# Altium project Urukul.PrjPCB (part 6 of 11)

## Sheet Urukul_FPGA_Config.SchDoc: =DocumentName
size A3; DocumentNumber: 1; Revision: 0; SheetNumber: 17; SheetTotal: 20; Version: 1.6; Author 1: Grzegorz Kasprowicz; Author 2: Filip Światkowski, Paweł Kulik, Maciej Przybysz; Author 3: Krzysztof Belewicz; Github: https://github.com/sinara-hw/Urukul; Last modified by: Krzysztof Belewicz
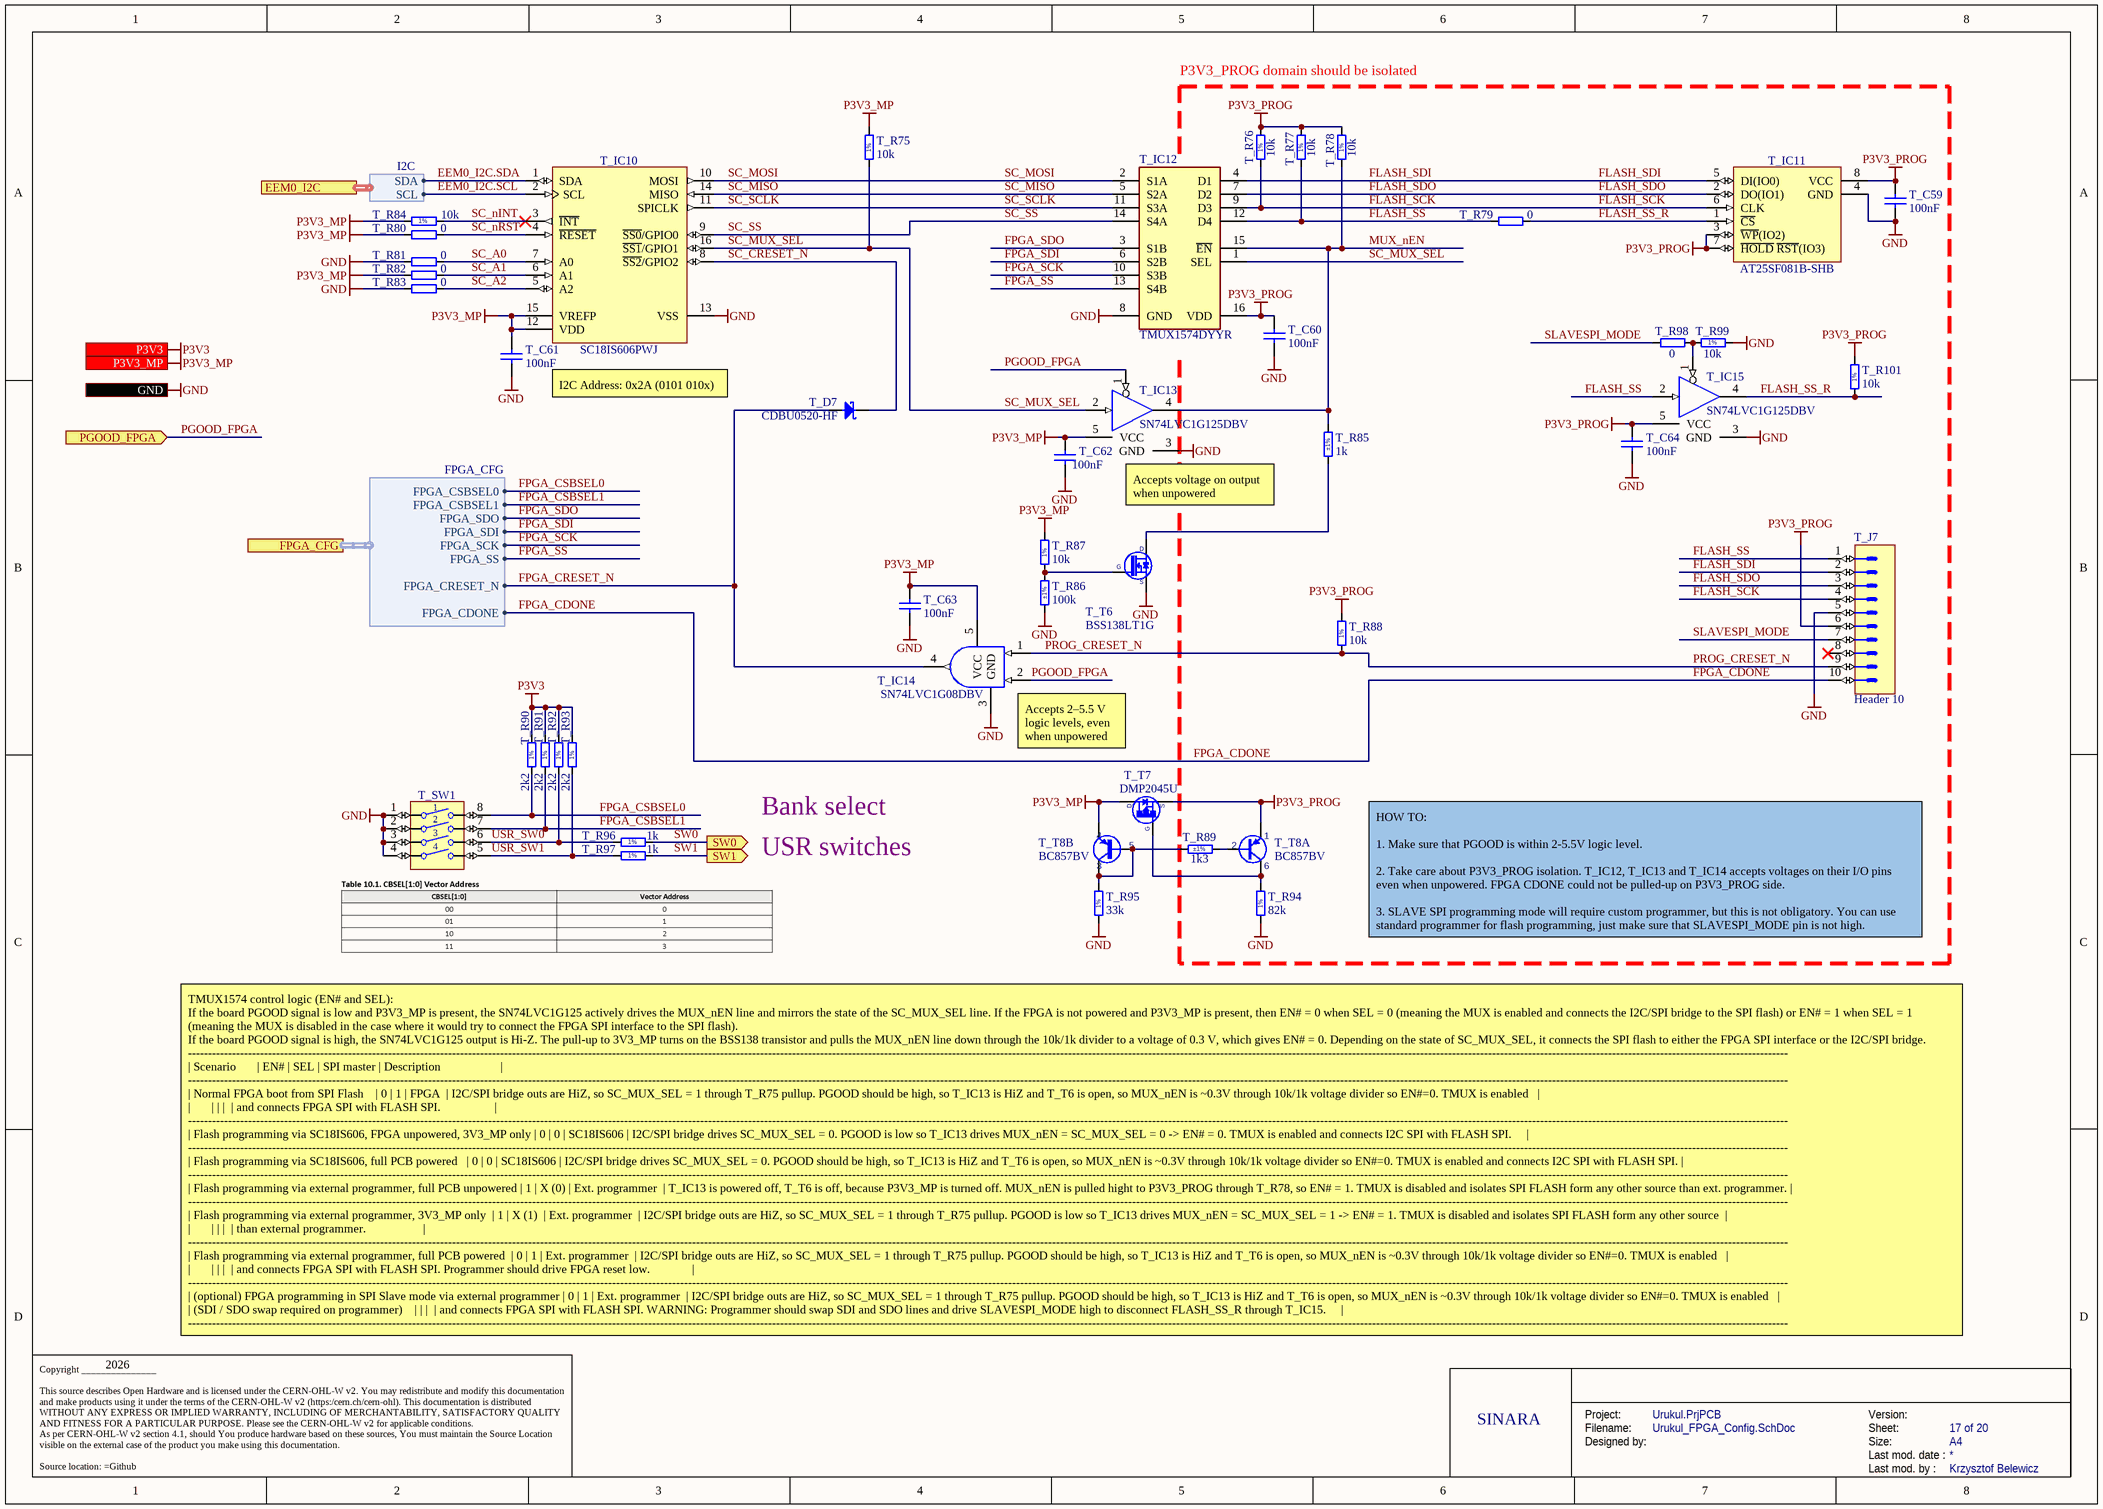
[diagram p13: Urukul_FPGA_Config.SchDoc]

### Parts
T_C59  100nF  [CAPC1005X55N]
T_C60  100nF  [CAPC1005X55N]
T_C61  100nF  [CAPC1005X55N]
T_C62  100nF  [CAPC1005X55N]
T_C63  100nF  [CAPC1005X55N]
T_C64  100nF  [CAPC1005X55N]
T_D7  CDBU0520-HF  [SOD-523F]
T_IC10  SC18IS606PWJ  [SOP65P640X110-16N]
T_IC11  AT25SF081B-SHB  [SOIC127P790X216-8N]
T_IC12  TMUX1574DYYR  [SOP50P326X110-16N]
T_IC13  SN74LVC1G125DBV  [SOT95P280X145-5N]
T_IC14  SN74LVC1G08DBV  [SOT95P280X145-5N]
T_IC15  SN74LVC1G125DBV  [SOT95P280X145-5N]
T_J7  Header 10  [HARWIN_M20-9980546]
T_R75  10k  [RESC1005X40N]
T_R76  10k  [RESC1005X40N]
T_R77  10k  [RESC1005X40N]
T_R78  10k  [RESC1005X40N]
T_R79  0  [RESC1005X40N]
T_R80  0  [RESC1005X40N]
T_R81  0  [RESC1005X40N]
T_R82  0  [RESC1005X40N]
T_R83  0  [RESC1005X40N]
T_R84  10k  [RESC1005X40N]
T_R85  1k  Tolerance: ±1%  [RESC1005X40N]
T_R86  100k  Tolerance: ±1%  [RESC1005X40N]
T_R87  10k  [RESC1005X40N]
T_R88  10k  [RESC1005X40N]
T_R89  1k3  Tolerance: ±1%  [RESC1005X40N]
T_R90  2k2  [RESC1005X40N]
T_R91  2k2  [RESC1005X40N]
T_R92  2k2  [RESC1005X40N]
T_R93  2k2  [RESC1005X40N]
T_R94  82k  [RESC1608X55N]
T_R95  33k  [RESC1005X40N]
T_R96  1k  [RESC1005X40N]
T_R97  1k  [RESC1005X40N]
T_R98  0  [RESC1005X40N]
T_R99  10k  [RESC1005X40N]
T_R101  10k  [RESC1005X40N]
T_SW1  Switch  [SW_TYCO_1571983-4]  (value not drawn)
T_T6  BSS138LT1G  [SOT95P240X110-3N]
T_T7  DMP2045U  [SOT95P240X110-3N]
T_T8  BC857BV  [SOTFL50P160X60-6N]  (parts A,B of 2)

### Ports
EEM0_I2C (harness I2C), FPGA_CFG (harness FPGA_CFG), GND, P3V3 (in), P3V3_MP (in), PGOOD_FPGA (in), SW0 (out), SW1 (out)

### Harnesses
FPGA_CFG: FPGA_CSBSEL0, FPGA_CSBSEL1, FPGA_SDO, FPGA_SDI, FPGA_SCK, FPGA_SS, FPGA_CRESET_N, FPGA_CDONE
I2C: SDA, SCL

### Nets
GND: T_C59.1 T_C60.1 T_C61.1 T_C62.1 T_C63.1 T_C64.1 T_IC10.13(VSS) T_IC11.4(GND) T_IC12.8(GND) T_IC13.3(GND) T_IC14.3(GND) T_IC15.3(GND) T_J7.5 T_R81.2 T_R83.2 T_R86.2 T_R94.1 T_R95.1 T_R99.2 T_SW1.1 T_SW1.2 T_SW1.3 T_SW1.4 T_T6.2(S) ; port GND
P3V3: T_R90.2 T_R91.2 T_R92.2 T_R93.2 ; port P3V3
P3V3_MP: T_C61.2 T_C62.2 T_C63.2 T_IC10.12(VDD) T_IC10.15(VREFP) T_IC13.5(VCC) T_IC14.5(VCC) T_R75.2 T_R80.2 T_R82.2 T_R84.1 T_R87.2 T_T7.3(D) T_T8.4(E) ; port P3V3_MP
P3V3_PROG: T_C59.2 T_C60.2 T_C64.2 T_IC11.3(~{WP}(IO2)) T_IC11.7(~{HOLD}_~{RST}(IO3)) T_IC11.8(VCC) T_IC12.16(VDD) T_IC15.5(VCC) T_J7.6 T_R76.2 T_R77.2 T_R78.2 T_R88.2 T_R101.2 T_T7.2(S) T_T8.1(E)
EEM0_I2C.SCL: T_IC10.2(SCL) ; port EEM0_I2C.SCL
EEM0_I2C.SDA: T_IC10.1(SDA) ; port EEM0_I2C.SDA
FLASH_SCK: T_IC11.6(CLK) T_IC12.9(D3) T_J7.4 T_R76.1
FLASH_SDI: T_IC11.5(DI(IO0)) T_IC12.4(D1) T_J7.2
FLASH_SDO: T_IC11.2(DO(IO1)) T_IC12.7(D2) T_J7.3
FLASH_SS: T_IC12.12(D4) T_IC15.2(IN) T_J7.1 T_R77.1 T_R79.1
FLASH_SS_R: T_IC11.1(~{CS}) T_IC15.4(OUT) T_R79.2 T_R101.1
FPGA_CDONE: T_J7.10 ; port FPGA_CFG.FPGA_CDONE
FPGA_CRESET_N: T_D7.2(A) T_IC14.4(Y) ; port FPGA_CFG.FPGA_CRESET_N  [project net FPGA_CFG.FPGA_CRESET_N]
FPGA_CSBSEL0: T_R90.1 T_SW1.8 ; port FPGA_CFG.FPGA_CSBSEL0  [project net FPGA_CFG.FPGA_CSBSEL0]
FPGA_CSBSEL1: T_R91.1 T_SW1.7 ; port FPGA_CFG.FPGA_CSBSEL1  [project net FPGA_CFG.FPGA_CSBSEL1]
FPGA_SCK: T_IC12.10(S3B) ; port FPGA_CFG.FPGA_SCK  [project net FPGA_CFG.FPGA_SCK]
FPGA_SDI: T_IC12.6(S2B) ; port FPGA_CFG.FPGA_SDI  [project net FPGA_CFG.FPGA_SDI]
FPGA_SDO: T_IC12.3(S1B) ; port FPGA_CFG.FPGA_SDO  [project net FPGA_CFG.FPGA_SDO]
FPGA_SS: T_IC12.13(S4B) ; port FPGA_CFG.FPGA_SS  [project net FPGA_CFG.FPGA_SS]
MUX_nEN: T_IC12.15(~{EN}) T_IC13.4(OUT) T_R78.1 T_R85.2
PGOOD_FPGA: T_IC13.1(~{G}) T_IC14.2(B) ; port PGOOD_FPGA
PROG_CRESET_N: T_IC14.1(A) T_J7.9 T_R88.1
SC_A0: T_IC10.7(A0) T_R81.1
SC_A1: T_IC10.6(A1) T_R82.1
SC_A2: T_IC10.5(A2) T_R83.1
SC_CRESET_N: T_D7.1(C) T_IC10.8(~{SS2}/GPIO2)
SC_MISO: T_IC10.14(MISO) T_IC12.5(S2A)
SC_MOSI: T_IC10.10(MOSI) T_IC12.2(S1A)
SC_MUX_SEL: T_IC10.16(~{SS1}/GPIO1) T_IC12.1(SEL) T_IC13.2(IN) T_R75.1
SC_nINT: T_IC10.3(~{INT}) T_R84.2
SC_nRST: T_IC10.4(~{RESET}) T_R80.1
SC_SCLK: T_IC10.11(SPICLK) T_IC12.11(S3A)
SC_SS: T_IC10.9(~{SS0}/GPIO0) T_IC12.14(S4A)
SLAVESPI_MODE: T_J7.7 T_R98.1
SW0: T_R96.1 ; port SW0
SW1: T_R97.1 ; port SW1
USR_SW0: T_R92.1 T_R96.2 T_SW1.6
USR_SW1: T_R93.1 T_R97.2 T_SW1.5
NetT_IC15_1: T_IC15.1(~{G}) T_R98.2 T_R99.1
NetT_R85_1: T_R85.1 T_T6.3(D)
NetT_R86_1: T_R86.1 T_R87.1 T_T6.1(G)
NetT_R89_1: T_R89.1 T_T8.2(B)
NetT_R89_2: T_R89.2 T_R95.2 T_T8.3(C) T_T8.5(B)
NetT_R94_2: T_R94.2 T_T7.1(G) T_T8.6(C)

Not connected (* = marked no-connect by the designer): T_J7 8*

### Notes on the sheet
- P3V3_PROG domain should be isolated
- I2C Address: 0x2A (0101 010x)
- (near T_IC13) Accepts voltage on output when unpowered
- (near T_IC14) Accepts 2–5.5 V logic levels, even when unpowered
- Bank select
- USR switches
- HOW TO:
  1. Make sure that PGOOD is within 2-5.5V logic level.
  2. Take care about P3V3_PROG isolation. T_IC12, T_IC13 and T_IC14 accepts voltages on their I/O pins even when unpowered. FPGA CDONE could not be pulled-up on P3V3_PROG side.
  3. SLAVE SPI programming mode will require custom programmer, but this is not obligatory. You can use standard programmer for flash programming, just make sure that SLAVESPI_MODE pin is not high.
- 2026
- TMUX1574 control logic (EN# and SEL):
  If the board PGOOD signal is low and P3V3_MP is present, the SN74LVC1G125 actively drives the MUX_nEN line and mirrors the state of the SC_MUX_SEL line. If the FPGA is not powered and P3V3_MP is present, then EN# = 0 when SEL = 0 (meaning the MUX is enabled and connects the I2C/SPI bridge to the SPI flash) or EN# = 1 when SEL = 1 (meaning the MUX is disabled in the case where it would try to connect the FPGA SPI interface to the SPI flash).
  If the board PGOOD signal is high, the SN74LVC1G125 output is Hi-Z. The pull-up to 3V3_MP turns on the BSS138 transistor and pulls the MUX_nEN line down through the 10k/1k divider to a voltage of 0.3 V, which gives EN# = 0. Depending on the state of SC_MUX_SEL, it connects the SPI flash to either the FPGA SPI interface or the I2C/SPI bridge.
  -------------------------------------------------------------------------------------------------------------------------------------------------------------------------------------------------------------------------------------------------------------------------------------------------------------------------------------------------------------------------------------------------------------------------------------------------
  | Scenario							| EN#	| SEL	| SPI master	| Description																				|
  -------------------------------------------------------------------------------------------------------------------------------------------------------------------------------------------------------------------------------------------------------------------------------------------------------------------------------------------------------------------------------------------------------------------------------------------------
  | Normal FPGA boot from SPI Flash				| 0	| 1	| FPGA		| I2C/SPI bridge outs are HiZ, so SC_MUX_SEL = 1 through T_R75 pullup. PGOOD should be high, so T_IC13 is HiZ and T_T6 is open, so MUX_nEN is ~0.3V through 10k/1k voltage divider so EN#=0. TMUX is enabled 		|
  |							|	|	|		| and connects FPGA SPI with FLASH SPI.																		|
  -------------------------------------------------------------------------------------------------------------------------------------------------------------------------------------------------------------------------------------------------------------------------------------------------------------------------------------------------------------------------------------------------------------------------------------------------
  | Flash programming via SC18IS606, FPGA unpowered, 3V3_MP only	| 0	| 0	| SC18IS606	| I2C/SPI bridge drives SC_MUX_SEL = 0. PGOOD is low so T_IC13 drives MUX_nEN = SC_MUX_SEL = 0 -> EN# = 0. TMUX is enabled and connects I2C SPI with FLASH SPI.					|
  -------------------------------------------------------------------------------------------------------------------------------------------------------------------------------------------------------------------------------------------------------------------------------------------------------------------------------------------------------------------------------------------------------------------------------------------------
  | Flash programming via SC18IS606, full PCB powered			| 0	| 0	| SC18IS606	| I2C/SPI bridge drives SC_MUX_SEL = 0. PGOOD should be high, so T_IC13 is HiZ and T_T6 is open, so MUX_nEN is ~0.3V through 10k/1k voltage divider so EN#=0. TMUX is enabled and connects I2C SPI with FLASH SPI.	|
  -------------------------------------------------------------------------------------------------------------------------------------------------------------------------------------------------------------------------------------------------------------------------------------------------------------------------------------------------------------------------------------------------------------------------------------------------
  | Flash programming via external programmer, full PCB unpowered	| 1	| X (0)	| Ext. programmer 	| T_IC13 is powered off, T_T6 is off, because P3V3_MP is turned off. MUX_nEN is pulled hight to P3V3_PROG through T_R78, so EN# = 1. TMUX is disabled and isolates SPI FLASH form any other source than ext. programmer.	|
  -------------------------------------------------------------------------------------------------------------------------------------------------------------------------------------------------------------------------------------------------------------------------------------------------------------------------------------------------------------------------------------------------------------------------------------------------
  | Flash programming via external programmer, 3V3_MP only		| 1	| X (1) 	| Ext. programmer 	| I2C/SPI bridge outs are HiZ, so SC_MUX_SEL = 1 through T_R75 pullup. PGOOD is low so T_IC13 drives MUX_nEN = SC_MUX_SEL = 1 -> EN# = 1. TMUX is disabled and isolates SPI FLASH form any other source		|
  |							|	|	|		| than external programmer.																			|
  -------------------------------------------------------------------------------------------------------------------------------------------------------------------------------------------------------------------------------------------------------------------------------------------------------------------------------------------------------------------------------------------------------------------------------------------------
  | Flash programming via external programmer, full PCB powered		| 0	| 1	| Ext. programmer 	| I2C/SPI bridge outs are HiZ, so SC_MUX_SEL = 1 through T_R75 pullup. PGOOD should be high, so T_IC13 is HiZ and T_T6 is open, so MUX_nEN is ~0.3V through 10k/1k voltage divider so EN#=0. TMUX is enabled 		|
  |							|	|	|		| and connects FPGA SPI with FLASH SPI. Programmer should drive FPGA reset low.														|
  -------------------------------------------------------------------------------------------------------------------------------------------------------------------------------------------------------------------------------------------------------------------------------------------------------------------------------------------------------------------------------------------------------------------------------------------------
  | (optional) FPGA programming in SPI Slave mode via external programmer	| 0	| 1	| Ext. programmer 	| I2C/SPI bridge outs are HiZ, so SC_MUX_SEL = 1 through T_R75 pullup. PGOOD should be high, so T_IC13 is HiZ and T_T6 is open, so MUX_nEN is ~0.3V through 10k/1k voltage divider so EN#=0. TMUX is enabled 		|
  | (SDI / SDO swap required on programmer)				|	|	|		| and connects FPGA SPI with FLASH SPI. WARNING: Programmer should swap SDI and SDO lines and drive SLAVESPI_MODE high to disconnect FLASH_SS_R through T_IC15.					|
  -------------------------------------------------------------------------------------------------------------------------------------------------------------------------------------------------------------------------------------------------------------------------------------------------------------------------------------------------------------------------------------------------------------------------------------------------
- SINARA
- Project:
- Designed by:
- Filename:
- Size:
- Version:
- Last mod. date :
- Sheet:
- A4
- Copyright _______________
  This source describes Open Hardware and is licensed under the CERN-OHL-W v2. You may redistribute and modify this documentation and make products using it under the terms of the CERN-OHL-W v2 (https:/cern.ch/cern-ohl). This documentation is distributed WITHOUT ANY EXPRESS OR IMPLIED WARRANTY, INCLUDING OF MERCHANTABILITY, SATISFACTORY QUALITY AND FITNESS FOR A PARTICULAR PURPOSE. Please see the CERN-OHL-W v2 for applicable conditions.
  As per CERN-OHL-W v2 section 4.1, should You produce hardware based on these sources, You must maintain the Source Location visible on the external case of the product you make using this documentation.
  Source location: =Github
- Last mod. by :
- (in symbol R0402_1K_1%_0.0625W_100PPM) 1%
- (in symbol R0402_2K2_1%_0.0625W_100PPM) 1%
- (in symbol R0402_10K_1%_0.0625W_100PPM) 1%
- (in symbol R0402_33K_1%_0.0625W_100PPM) 1%
- (in symbol R0603_82K_1%_0.1W_100PPM) 1%

### Library data of the parts
T_C59-T_C64 = CC0402_100NF_16V_10%_X5R: as C85 on sheet Urukul_FPGA; Part Number: CC0402_100NF_16V_10%_X5R; Component Kind: Standard; Component Type: Standard; Pin Count: 2; Value: 100nF; Status: None; Manufacturer Part Number: CC0402_100NF_16V_10%_X5R; Case: 0402; Mounted: Yes; Socket: No; SMD: Yes; Sense: No; Manufacturer1 Example: MURATA; Manufacturer1 ComponentHeight: 0.55mm; HelpURL: \\cern.ch\dfs\Applications\Altium\Datasheets\CC0402_X5R_MURATA_GRM.pdf; Author: CERN DEM JLC; CreateDate: 10.12.2013; LatestRevisionDate: 10.12.2013
T_D7 = CDBU0520-HF: Schottky Diode; Part Description: 20V Surface mount Schottky Barrier Diode; Manufacturer: COMCHIP; Voltage: 20V; Power: 500mA; PressFit: No; Bonding: No; Part Number: CDBU0520-HF; Component Kind: Standard; Component Type: Standard; Device: CDBU0520-HF; PackageDescription: Small Outline Diode Flat Lead (SOD-523F), Body; 1.80mm L X 1mm W X 0.85mm H; Manufacturer Part Number: CDBU0520-HF; Pin Count: 2; Case: SOD-523F; Mounted: Yes; Socket: No; SMD: Yes; Sense: No; ComponentHeight: 1mm; HelpURL: \\cern.ch\dfs\Applications\Altium\Datasheets\CDBU0520-HF.pdf; Author: CERN DEM HF; CreateDate: 13.10.2023; LatestRevisionDate: 13.10.2023
T_IC10 = SC18IS606PWJ: I2C-bus to SPI bridge; Manufacturer: NXP SEMICONDUCTORS; PressFit: No; Bonding: No; Part Number: SC18IS606PWJ; Component Kind: Standard; Component Type: Standard; Device: SC18IS606PWJ; PackageDescription: SOP, 0.65mm pitch; 16 pin, 4.40mm W X 5.00mm L X 1.10mm H body IPC Medium Density; Part Description: I2C-Bus to SPI Bridge; Manufacturer Part Number: SC18IS606PWJ; Pin Count: 16; Case: TSSOP16; Mounted: Yes; Socket: No; SMD: Yes; Sense: No; ComponentHeight: 1.1mm; HelpURL: \\cern.ch\dfs\Applications\Altium\Datasheets\SC18IS602B.pdf; Author: GK; CreateDate: 14/12/2015; LatestRevisionDate: 14/12/2015
T_IC11 = MEM_AT25SF081B-SHB: 8M-bit Serial Flash Memory with uniform 4KB sectors and Dual/Quad SPI and QPI; Manufacturer: Renesas; PressFit: No; Bonding: No; Part Number: AT25SF081B-SHB; Component Kind: Standard; Component Type: Standard; Device: AT25SF081B-SHB; PackageDescription: SOIC, 1.27mm Pitch; 8 Pin, 5.285mm W X 5.335mm L X 2.16mm H body, IPC Medium Density; Part Description: 8M-bit Serial Flash Memory with uniform 4KB sectors and Dual/Quad SPI and QPI; Manufacturer Part Number: AT25SF081B-SHB; Pin Count: 8; Case: SOIC8; Mounted: Yes; Socket: No; SMD: Yes; Sense: No; ComponentHeight: 2.16mm; HelpURL: \\cern.ch\dfs\Applications\Altium\Datasheets\W25Q128FVSIG.pdf; Author: GK; CreateDate: 26/01/2018; LatestRevisionDate: 26/01/2018
T_IC12 = TMUX1574DYYR: Integrated Circuit; Manufacturer_Name: Texas Instruments; Datasheet Link: https://www.ti.com/lit/gpn/TMUX1574; Height: 1.1mm; Manufacturer_Part_Number: TMUX1574DYYR; Mouser Part Number: 595-TMUX1574DYYR; Mouser Price/Stock: https://www.mouser.co.uk/ProductDetail/Texas-Instruments/TMUX1574DYYR?qs=B6kkDfuK7%2FDgs0e8M6dtlw%3D%3D; Arrow Part Number: TMUX1574DYYR; Arrow Price/Stock: https://www.arrow.com/en/products/tmux1574dyyr/texas-instruments.html?utm_currency=USD&region=nac
T_IC13 T_IC15 = SN74LVC1G125DBV: Single Bus Buffer Gate With 3-State Output; Part Description: Single Bus Buffer Gate with 3-State Outputs; Manufacturer: TEXAS INSTRUMENTS; PressFit: No; Bonding: No; Part Number: SN74LVC1G125DBV; Component Kind: Standard; Component Type: Standard; Device: SN74LVC1G125DBV; PackageDescription: SOT, 0.95mm Pitch; 5 Pin, 1.60mm W X 2.90mm L X 1.45mm H body, IPC Medium Density; Manufacturer Part Number: SN74LVC1G125DBV; Pin Count: 5; Case: SOT23-5; Mounted: Yes; Socket: No; SMD: Yes; Sense: No; ComponentHeight: 1.45mm; Author: CERN DEM HF; HelpURL: \\cern.ch\dfs\Applications\Altium\Datasheets\SN74LVC1G125.pdf; CreateDate: 15.11.2022; LatestRevisionDate: 15.11.2022
T_IC14 = SN74LVC1G08DBV: Single 2-Input AND Gate; Part Description: Single 2-Input Positive-AND Gate; Manufacturer: TEXAS INSTRUMENTS; PressFit: No; Bonding: No; Part Number: SN74LVC1G08DBV; Component Kind: Standard; Component Type: Standard; Device: SN74LVC1G08DBV; PackageDescription: SOT, 0.95mm Pitch; 5 Pin, 1.60mm W X 2.90mm L X 1.45mm H body, IPC Medium Density; Manufacturer Part Number: SN74LVC1G08DBV; Pin Count: 5; Case: SOT23-5; Mounted: Yes; Socket: No; SMD: Yes; Sense: No; ComponentHeight: 1.45mm; Author: CERN DEM JLC; HelpURL: \\cern.ch\dfs\Applications\Altium\Datasheets\SN74LVC1G08.pdf; CreateDate: 28.08.2012; LatestRevisionDate: 27.10.2021
T_J7 = HARWIN_M20-9980546: Connector 10 Male; Part Description: 10 Contacts - Pitch 2.54mm - Dual Row Straight Header (Lead Length 6.1mm, Insulator 2.54mm); Manufacturer: HARWIN; PressFit: No; Part Number: HARWIN_M20-9980546; Component Kind: Standard; Component Type: Standard; Pin Count: 10; Family: Header 10; Mounted: Yes; Socket: No; SMD: No; Sense: No; Status: None; Manufacturer Part Number: M20-9980546; ComponentHeight: 8.64mm; HelpURL: \\cern.ch\dfs\Applications\Altium\Datasheets\HARWIN_M20-9980546.pdf; Author: CERN DEM MR; CreateDate: 9/15/2017; LatestRevisionDate: 9/15/2017
T_R75-T_R78 T_R84 T_R87 T_R88 T_R99 T_R101 = R0402_10K_1%_0.0625W_100PPM: Resistor - 1%; Part Description: General Purpose Thick Film Chip Resistor; Manufacturer: GENERIC; Manufacturer1 Part Number: 232270671003L; TC: ±100ppm/°C; Table: Resistors SMD; Part Number: R0402_10K_1%_0.0625W_100PPM; Component Kind: Standard; Component Type: Standard; Pin Count: 2; Value: 10k; Status: Not recommended; Power: 0.0625W; Tolerance: ±1%; Manufacturer Part Number: R0402_10K_1%_0.0625W_100PPM; Case: 0402; Mounted: Yes; Socket: No; SMD: Yes; Manufacturer1 Example: YAGEO PHYCOMP; Manufacturer1 ComponentHeight: 0.4mm; HelpURL: \\cern.ch\dfs\Applications\Altium\Datasheets\R0402_Phycomp_RC0402.pdf; Author: CERN DEM JLC; CreateDate: 2007-12-03; LatestRevisionDate: 2012-10-17
T_R79-T_R83 T_R98 = R0402_0R_JUMPER: Resistor; Part Description: 1A (0.05R Max DC Resistance) Zero Ohm Jumper; Manufacturer: GENERIC; Manufacturer1 Part Number: 232270591001L; PressFit: No; Part Number: R0402_0R_JUMPER; Component Kind: Standard; Component Type: Standard; Pin Count: 2; Value: 0; Status: Not Recommended; Manufacturer Part Number: R0402_0R_JUMPER; Case: 0402; Mounted: Yes; Sense: No; Socket: No; SMD: Yes; Manufacturer1 Example: YAGEO PHYCOMP; Manufacturer1 ComponentHeight: 0.4mm; HelpURL: \\cern.ch\dfs\Applications\Altium\Datasheets\R0402_Phycomp_RC0402.pdf; Author: CERN DEM JLC; CreateDate: 03.12.2007; LatestRevisionDate: 17.10.2012
T_R85 T_R96 T_R97 = R0402_1K_1%_0.0625W_100PPM: as R31 on sheet CLK_SYNC; Part Number: R0402_1K_1%_0.0625W_100PPM; Component Kind: Standard; Component Type: Standard; Pin Count: 2; Value: 1k; Status: Not Recommended; Power: 0.0625W; Manufacturer Part Number: R0402_1K_1%_0.0625W_100PPM; Case: 0402; Mounted: Yes; Sense: No; Socket: No; SMD: Yes; Manufacturer1 Example: YAGEO PHYCOMP; Manufacturer1 ComponentHeight: 0.4mm; HelpURL: \\cern.ch\dfs\Applications\Altium\Datasheets\R0402_Phycomp_RC0402.pdf; Author: CERN DEM JLC; CreateDate: 03.12.2007; LatestRevisionDate: 17.10.2012
  T_R96 T_R97: Tolerance: ±1%
T_R86 = R0402_100K_1%_0.0625W_100PPM: Resistor - 1%; Part Description: General Purpose Thick Film Chip Resistor; Manufacturer: GENERIC; Manufacturer1 Part Number: 232270671004L; TC: ±100ppm/°C; PressFit: No; Part Number: R0402_100K_1%_0.0625W_100PPM; Component Kind: Standard; Component Type: Standard; Pin Count: 2; Value: 100k; Status: Not Recommended; Power: 0.0625W; Manufacturer Part Number: R0402_100K_1%_0.0625W_100PPM; Case: 0402; Mounted: Yes; Sense: No; Socket: No; SMD: Yes; Manufacturer1 Example: YAGEO PHYCOMP; Manufacturer1 ComponentHeight: 0.4mm; HelpURL: \\cern.ch\dfs\Applications\Altium\Datasheets\R0402_Phycomp_RC0402.pdf; Author: CERN DEM JLC; CreateDate: 03.12.2007; LatestRevisionDate: 17.10.2012
T_R89 = R0402_1K3_1%_0.0625W_100PPM: Resistor - 1%; Part Description: General Purpose Thick Film Chip Resistor; Manufacturer: GENERIC; Manufacturer1 Part Number: 232270671302L; TC: ±100ppm/°C; PressFit: No; Part Number: R0402_1K3_1%_0.0625W_100PPM; Component Kind: Standard; Component Type: Standard; Pin Count: 2; Value: 1k3; Status: Not Recommended; Power: 0.0625W; Manufacturer Part Number: R0402_1K3_1%_0.0625W_100PPM; Case: 0402; Mounted: Yes; Sense: No; Socket: No; SMD: Yes; Manufacturer1 Example: YAGEO PHYCOMP; Manufacturer1 ComponentHeight: 0.4mm; HelpURL: \\cern.ch\dfs\Applications\Altium\Datasheets\R0402_Phycomp_RC0402.pdf; Author: CERN DEM JLC; CreateDate: 03.12.2007; LatestRevisionDate: 17.10.2012
T_R90-T_R93 = R0402_2K2_1%_0.0625W_100PPM: Resistor - 1%; Part Description: General Purpose Thick Film Chip Resistor; Manufacturer: GENERIC; Manufacturer1 Part Number: 232270672202L; TC: ±100ppm/°C; Table: Resistors SMD; Part Number: R0402_2K2_1%_0.0625W_100PPM; Component Kind: Standard; Component Type: Standard; Pin Count: 2; Value: 2k2; Status: Not recommended; Power: 0.0625W; Tolerance: ±1%; Manufacturer Part Number: R0402_2K2_1%_0.0625W_100PPM; Case: 0402; Mounted: Yes; Socket: No; SMD: Yes; Manufacturer1 Example: YAGEO PHYCOMP; Manufacturer1 ComponentHeight: 0.4mm; HelpURL: \\cern.ch\dfs\Applications\Altium\Datasheets\R0402_Phycomp_RC0402.pdf; Author: CERN DEM JLC; CreateDate: 2007-12-03; LatestRevisionDate: 2012-10-17
T_R94 = R0603_82K_1%_0.1W_100PPM: Resistor - 1%; Part Description: General Purpose Thick Film Chip Resistor; Manufacturer: GENERIC; Manufacturer1 Part Number: NRC06F8202TRF; Power: 0.1W; TC: ±100ppm/°C; Part Number: R0603_82K_1%_0.1W_100PPM; Component Kind: Standard; Component Type: Standard; Pin Count: 2; Value: 82k; Status: Preferred; Tolerance: ±1%; Manufacturer Part Number: R0603_82K_1%_0.1W_100PPM; Case: 0603; Mounted: Yes; Sense: No; Socket: No; SMD: Yes; Manufacturer1 Example: NIC COMPONENT; Manufacturer1 ComponentHeight: 0.55mm; HelpURL: \\cern.ch\dfs\Applications\Altium\Datasheets\R0603_NIC_NRC.pdf; Author: CERN DEM JLC; CreateDate: 03.12.2007; LatestRevisionDate: 13.03.2008
T_R95 = R0402_33K_1%_0.0625W_100PPM: Resistor - 1%; Part Description: General Purpose Thick Film Chip Resistor; Manufacturer: GENERIC; Manufacturer1 Part Number: 232270673303L; TC: ±100ppm/°C; PressFit: No; Part Number: R0402_33K_1%_0.0625W_100PPM; Component Kind: Standard; Component Type: Standard; Pin Count: 2; Value: 33k; Status: Not Recommended; Power: 0.0625W; Tolerance: ±1%; Manufacturer Part Number: R0402_33K_1%_0.0625W_100PPM; Case: 0402; Mounted: Yes; Sense: No; Socket: No; SMD: Yes; Manufacturer1 Example: YAGEO PHYCOMP; Manufacturer1 ComponentHeight: 0.4mm; HelpURL: \\cern.ch\dfs\Applications\Altium\Datasheets\R0402_Phycomp_RC0402.pdf; Author: CERN DEM JLC; CreateDate: 03.12.2007; LatestRevisionDate: 17.10.2012
T_SW1 = SW_TYCO_1571983-4: as SW1 on sheet Urukul_FPGA; Part Number: SW_TYCO_1571983-4; Component Kind: Standard; Component Type: Standard; Pin Count: 8; PackageDescription: Pitch 1.27mm,  Body 6.2x6.2mm, 4 Ways SPST Surface-Mount DIP Switch, TYCO GDH Series; Family: Switch; Mounted: Yes; Socket: No; SMD: Yes; Sense: No; Status: None; ComponentHeight: 2.31mm; HelpURL: \\cern.ch\dfs\Applications\Altium\Datasheets\SW_TYCO_1571983-4.pdf; Author: CERN DEM JLC; CreateDate: 08/01/2009; LatestRevisionDate: 08/01/2009
T_T6 = BSS138LT1G: N-CHANNEL MOSFET WITH DIODE; Part Description: 50V, 200mA N-Channel Enhancement Mode Field-Effect Transistor; Manufacturer: ON SEMICONDUCTOR; PressFit: No; Bonding: No; Part Number: BSS138LT1G; Component Kind: Standard; Component Type: Standard; Device: BSS138LT1G; PackageDescription: SOT23, 0.95mm Pitch; 3 Pin, 1.40mm W X 3.00mm L X 1.10mm H body, IPC Medium Density; Manufacturer Part Number: BSS138L; Pin Count: 3; Case: SOT23-3; Mounted: Yes; Socket: No; SMD: Yes; Sense: No; ComponentHeight: 1.11mm; HelpURL: \\cern.ch\dfs\Applications\Altium\Datasheets\BSS138LT1G.pdf; Author: CERN DEM JLC; CreateDate: 23.03.2009; LatestRevisionDate: 25.05.2022
T_T7 = DMP2045U: P-CHANNEL MOSFET WITH DIODE; Part Description: 20V, 4.3A, P-Channel Enhancement Mode MOSFET; Manufacturer: DIODES INCORPORATED; PressFit: No; Bonding: No; Part Number: DMP2045U; Component Kind: Standard; Component Type: Standard; Device: DMP2045U; PackageDescription: SOT23, 0.95mm Pitch; 3 Pin, 1.40mm W X 3.00mm L X 1.10mm H body, IPC Medium Density; Manufacturer Part Number: DMP2045U; Pin Count: 3; Case: SOT23-3; Mounted: Yes; Socket: No; SMD: Yes; Sense: No; ComponentHeight: 1.4mm; HelpURL: \\cern.ch\dfs\Applications\Altium\Datasheets\DMP2045U.pdf; Author: CERN DEM HF; CreateDate: 24.09.2025; LatestRevisionDate: 24.09.2025
T_T8 = BC857BV: 45V, 100mA PNP General Purpose Double Transistor; Part Description: -45V -100mA PNP General Purpose Double Transistor; Manufacturer: NXP SEMICONDUCTORS; PressFit: No; Bonding: No; Part Number: BC857BV; Component Kind: Standard; Component Type: Standard; Device: BC857BV; PackageDescription: SOTFL (SOT666), 0.50mm, Pitch; 6 Pin, 1.20mm W X 1.60mm L X 0.60mm H Body, IPC Medium Density; Manufacturer Part Number: BC857BV; Pin Count: 6; Case: SOT666; Mounted: Yes; Socket: No; SMD: Yes; Sense: No; ComponentHeight: 0.6mm; HelpURL: \\cern.ch\dfs\Applications\Altium\Datasheets\BC857BV.pdf; Author: CERN DEM JLC; CreateDate: 01/12/2011; LatestRevisionDate: 01/12/2011

## Sheet Urukul_FPGA_LVDS.SchDoc: =DocumentName
size A3; DocumentNumber: 1; Revision: 0; SheetNumber: 15; SheetTotal: 17; Version: 1.6; Author 1: Grzegorz Kasprowicz; Author 2: Filip Światkowski, Paweł Kulik, Maciej Przybysz; Author 3: Krzysztof Belewicz; Github: https://github.com/sinara-hw/Urukul; Last modified by: Krzysztof Belewicz
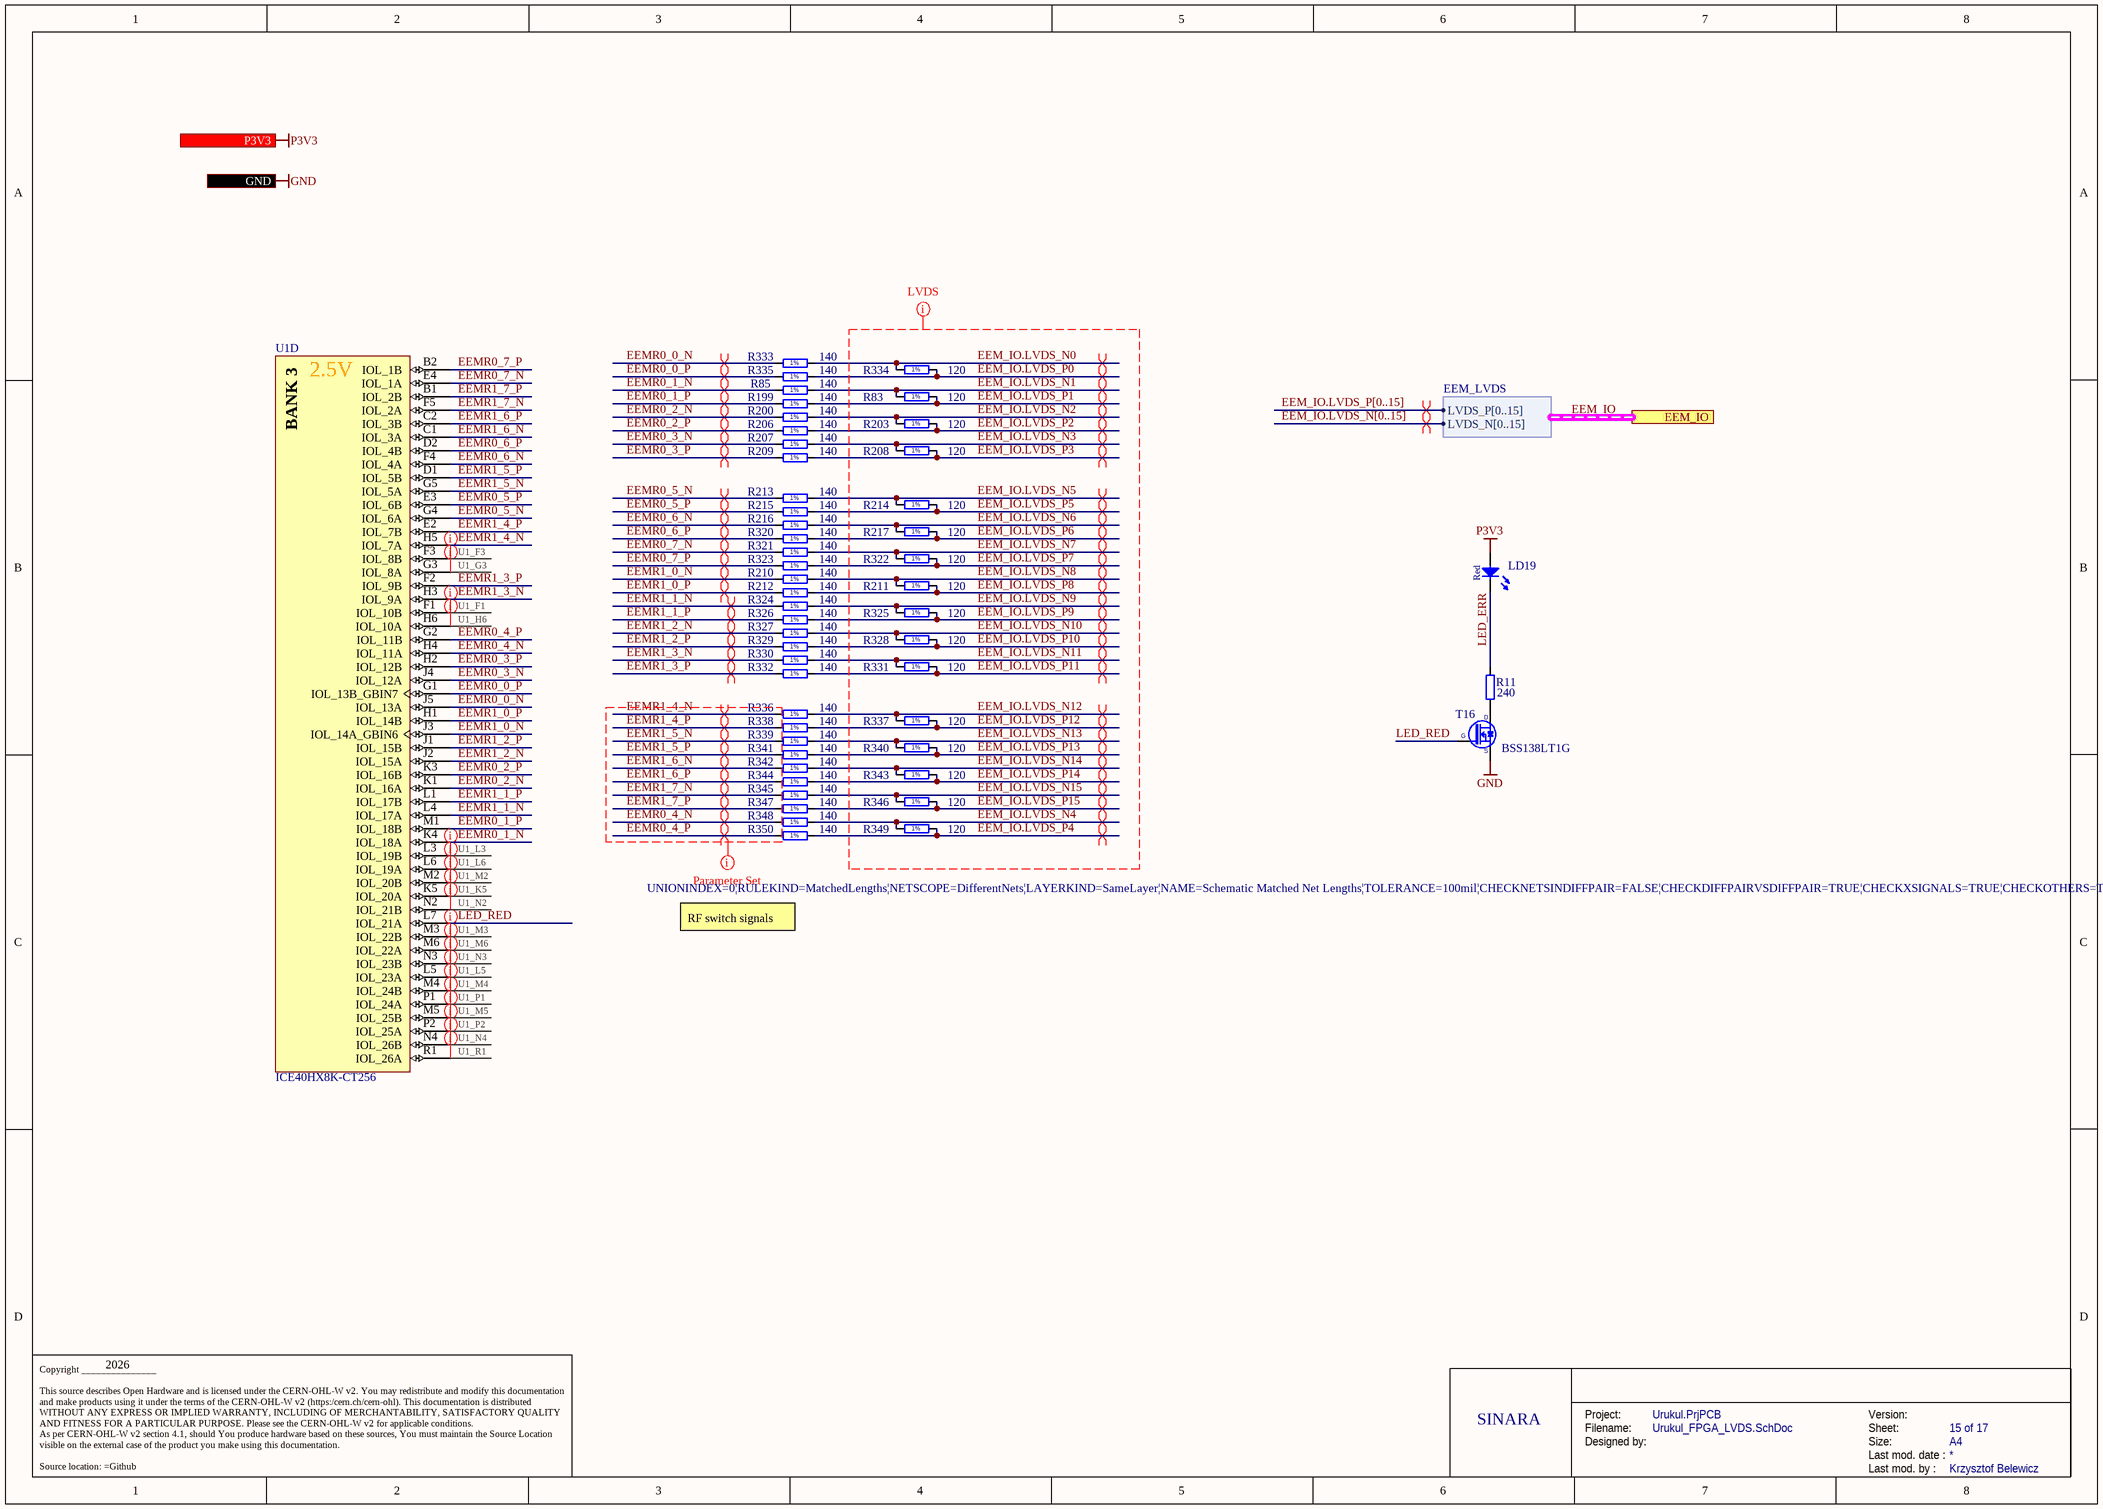
[diagram p14: Urukul_FPGA_LVDS.SchDoc]

### Parts
LD19  Red  [LED_AVAGO_HSMC-C120]
R11  240  [RESC1005X40N]
R83  120  [RESC1005X40N]
R85  140  [RESC0603X28N]
R199  140  [RESC0603X28N]
R200  140  [RESC0603X28N]
R203  120  [RESC1005X40N]
R206  140  [RESC0603X28N]
R207  140  [RESC0603X28N]
R208  120  [RESC1005X40N]
R209  140  [RESC0603X28N]
R210  140  [RESC0603X28N]
R211  120  [RESC1005X40N]
R212  140  [RESC0603X28N]
R213  140  [RESC0603X28N]
R214  120  [RESC1005X40N]
R215  140  [RESC0603X28N]
R216  140  [RESC0603X28N]
R217  120  [RESC1005X40N]
R320  140  [RESC0603X28N]
R321  140  [RESC0603X28N]
R322  120  [RESC1005X40N]
R323  140  [RESC0603X28N]
R324  140  [RESC0603X28N]
R325  120  [RESC1005X40N]
R326  140  [RESC0603X28N]
R327  140  [RESC0603X28N]
R328  120  [RESC1005X40N]
R329  140  [RESC0603X28N]
R330  140  [RESC0603X28N]
R331  120  [RESC1005X40N]
R332  140  [RESC0603X28N]
R333  140  [RESC0603X28N]
R334  120  [RESC1005X40N]
R335  140  [RESC0603X28N]
R336  140  [RESC0603X28N]
R337  120  [RESC1005X40N]
R338  140  [RESC0603X28N]
R339  140  [RESC0603X28N]
R340  120  [RESC1005X40N]
R341  140  [RESC0603X28N]
R342  140  [RESC0603X28N]
R343  120  [RESC1005X40N]
R344  140  [RESC0603X28N]
R345  140  [RESC0603X28N]
R346  120  [RESC1005X40N]
R347  140  [RESC0603X28N]
R348  140  [RESC0603X28N]
R349  120  [RESC1005X40N]
R350  140  [RESC0603X28N]
T16  BSS138LT1G  [SOT95P240X110-3N]
U1  ICE40HX8K-CT256  [LATC-caBGA-256]  (part D of 5)

### Ports
EEM_IO (harness EEM_LVDS), GND, P3V3 (in)

### Harnesses
EEM_LVDS: LVDS_P[0..15], LVDS_N[0..15]

### Nets
GND: T16.2(S) ; port GND
P3V3: LD19.2(A) ; port P3V3
EEM_IO.LVDS_N0: R333.2 R334.1
EEM_IO.LVDS_N1: R83.1 R85.2
EEM_IO.LVDS_N2: R200.2 R203.1
EEM_IO.LVDS_N3: R207.2 R208.1
EEM_IO.LVDS_N4: R348.2 R349.1
EEM_IO.LVDS_N5: R213.2 R214.1
EEM_IO.LVDS_N6: R216.2 R217.1
EEM_IO.LVDS_N7: R321.2 R322.1
EEM_IO.LVDS_N8: R210.2 R211.1
EEM_IO.LVDS_N9: R324.2 R325.1
EEM_IO.LVDS_N10: R327.2 R328.1
EEM_IO.LVDS_N11: R330.2 R331.1
EEM_IO.LVDS_N12: R336.2 R337.1
EEM_IO.LVDS_N13: R339.2 R340.1
EEM_IO.LVDS_N14: R342.2 R343.1
EEM_IO.LVDS_N15: R345.2 R346.1
EEM_IO.LVDS_P0: R334.2 R335.2
EEM_IO.LVDS_P1: R83.2 R199.2
EEM_IO.LVDS_P2: R203.2 R206.2
EEM_IO.LVDS_P3: R208.2 R209.2
EEM_IO.LVDS_P4: R349.2 R350.2
EEM_IO.LVDS_P5: R214.2 R215.2
EEM_IO.LVDS_P6: R217.2 R320.2
EEM_IO.LVDS_P7: R322.2 R323.2
EEM_IO.LVDS_P8: R211.2 R212.2
EEM_IO.LVDS_P9: R325.2 R326.2
EEM_IO.LVDS_P10: R328.2 R329.2
EEM_IO.LVDS_P11: R331.2 R332.2
EEM_IO.LVDS_P12: R337.2 R338.2
EEM_IO.LVDS_P13: R340.2 R341.2
EEM_IO.LVDS_P14: R343.2 R344.2
EEM_IO.LVDS_P15: R346.2 R347.2
EEMR0_0_N: R333.1 U1.J5(IOL_13A)
EEMR0_0_P: R335.1 U1.G1(IOL_13B_GBIN7)
EEMR0_1_N: R85.1 U1.K4(IOL_18A)
EEMR0_1_P: R199.1 U1.M1(IOL_18B)
EEMR0_2_N: R200.1 U1.K1(IOL_16A)
EEMR0_2_P: R206.1 U1.K3(IOL_16B)
EEMR0_3_N: R207.1 U1.J4(IOL_12A)
EEMR0_3_P: R209.1 U1.H2(IOL_12B)
EEMR0_4_N: R348.1 U1.H4(IOL_11A)
EEMR0_4_P: R350.1 U1.G2(IOL_11B)
EEMR0_5_N: R213.1 U1.G4(IOL_6A)
EEMR0_5_P: R215.1 U1.E3(IOL_6B)
EEMR0_6_N: R216.1 U1.F4(IOL_4A)
EEMR0_6_P: R320.1 U1.D2(IOL_4B)
EEMR0_7_N: R321.1 U1.E4(IOL_1A)
EEMR0_7_P: R323.1 U1.B2(IOL_1B)
EEMR1_0_N: R210.1 U1.J3(IOL_14A_GBIN6)
EEMR1_0_P: R212.1 U1.H1(IOL_14B)
EEMR1_1_N: R324.1 U1.L4(IOL_17A)
EEMR1_1_P: R326.1 U1.L1(IOL_17B)
EEMR1_2_N: R327.1 U1.J2(IOL_15A)
EEMR1_2_P: R329.1 U1.J1(IOL_15B)
EEMR1_3_N: R330.1 U1.H3(IOL_9A)
EEMR1_3_P: R332.1 U1.F2(IOL_9B)
EEMR1_4_N: R336.1 U1.H5(IOL_7A)
EEMR1_4_P: R338.1 U1.E2(IOL_7B)
EEMR1_5_N: R339.1 U1.G5(IOL_5A)
EEMR1_5_P: R341.1 U1.D1(IOL_5B)
EEMR1_6_N: R342.1 U1.C1(IOL_3A)
EEMR1_6_P: R344.1 U1.C2(IOL_3B)
EEMR1_7_N: R345.1 U1.F5(IOL_2A)
EEMR1_7_P: R347.1 U1.B1(IOL_2B)
LED_ERR: LD19.1(C) R11.1
LED_RED: T16.1(G) U1.L7(IOL_21A)
U1_F1: U1.F1(IOL_10B)
U1_F3: U1.F3(IOL_8B)
U1_G3: U1.G3(IOL_8A)
U1_H6: U1.H6(IOL_10A)
U1_K5: U1.K5(IOL_20A)
U1_L3: U1.L3(IOL_19B)
U1_L5: U1.L5(IOL_23A)
U1_L6: U1.L6(IOL_19A)
U1_M2: U1.M2(IOL_20B)
U1_M3: U1.M3(IOL_22B)
U1_M4: U1.M4(IOL_24B)
U1_M5: U1.M5(IOL_25B)
U1_M6: U1.M6(IOL_22A)
U1_N2: U1.N2(IOL_21B)
U1_N3: U1.N3(IOL_23B)
U1_N4: U1.N4(IOL_26B)
U1_P1: U1.P1(IOL_24A)
U1_P2: U1.P2(IOL_25A)
U1_R1: U1.R1(IOL_26A)
NetR11_2: R11.2 T16.3(D)

### Buses and harness runs
bus EEM_IO.LVDS_N[0..15]
bus EEM_IO.LVDS_P[0..15]
harness EEM_IO = port EEM_IO

### Layout directives
differential pair: EEM_IO.LVDS_N0, EEM_IO.LVDS_N1, EEM_IO.LVDS_N2, EEM_IO.LVDS_N3, EEM_IO.LVDS_N4, EEM_IO.LVDS_N5, EEM_IO.LVDS_N6, EEM_IO.LVDS_N7, EEM_IO.LVDS_N8, EEM_IO.LVDS_N9, EEM_IO.LVDS_N10, EEM_IO.LVDS_N11, EEM_IO.LVDS_N12, EEM_IO.LVDS_N13, EEM_IO.LVDS_N14, EEM_IO.LVDS_N15, EEM_IO.LVDS_P0, EEM_IO.LVDS_P1, EEM_IO.LVDS_P2, EEM_IO.LVDS_P3, EEM_IO.LVDS_P4, EEM_IO.LVDS_P5, EEM_IO.LVDS_P6, EEM_IO.LVDS_P7, EEM_IO.LVDS_P8, EEM_IO.LVDS_P9, EEM_IO.LVDS_P10, EEM_IO.LVDS_P11, EEM_IO.LVDS_P12, EEM_IO.LVDS_P13, EEM_IO.LVDS_P14, EEM_IO.LVDS_P15, EEMR0_0_N, EEMR0_0_P, EEMR0_1_N, EEMR0_1_P, EEMR0_2_N, EEMR0_2_P, EEMR0_3_N, EEMR0_3_P, EEMR0_4_N, EEMR0_4_P, EEMR0_5_N, EEMR0_5_P, EEMR0_6_N, EEMR0_6_P, EEMR0_7_N, EEMR0_7_P, EEMR1_0_N, EEMR1_0_P, EEMR1_1_N, EEMR1_1_P, EEMR1_2_N, EEMR1_2_P, EEMR1_3_N, EEMR1_3_P, EEMR1_4_N, EEMR1_4_P, EEMR1_5_N, EEMR1_5_P, EEMR1_6_N, EEMR1_6_P, EEMR1_7_N, EEMR1_7_P
net class LVDS: EEM_IO.LVDS_N0, EEM_IO.LVDS_N1, EEM_IO.LVDS_N2, EEM_IO.LVDS_N3, EEM_IO.LVDS_N4, EEM_IO.LVDS_N5, EEM_IO.LVDS_N6, EEM_IO.LVDS_N7, EEM_IO.LVDS_N8, EEM_IO.LVDS_N9, EEM_IO.LVDS_N10, EEM_IO.LVDS_N11, EEM_IO.LVDS_N12, EEM_IO.LVDS_N13, EEM_IO.LVDS_N14, EEM_IO.LVDS_N15, EEM_IO.LVDS_P0, EEM_IO.LVDS_P1, EEM_IO.LVDS_P2, EEM_IO.LVDS_P3, EEM_IO.LVDS_P4, EEM_IO.LVDS_P5, EEM_IO.LVDS_P6, EEM_IO.LVDS_P7, EEM_IO.LVDS_P8, EEM_IO.LVDS_P9, EEM_IO.LVDS_P10, EEM_IO.LVDS_P11, EEM_IO.LVDS_P12, EEM_IO.LVDS_P13, EEM_IO.LVDS_P14, EEM_IO.LVDS_P15
rule Matched Net Lengths [Tolerance = 2.54mm]; net class RFSW_CPLD: EEMR0_4_N, EEMR0_4_P, EEMR1_4_N, EEMR1_4_P, EEMR1_5_N, EEMR1_5_P, EEMR1_6_N, EEMR1_6_P, EEMR1_7_N, EEMR1_7_P
net class Unused: U1_F1, U1_F3, U1_G3, U1_H6, U1_K5, U1_L3, U1_L5, U1_L6, U1_M2, U1_M3, U1_M4, U1_M5, U1_M6, U1_N2, U1_N3, U1_N4, U1_P1, U1_P2, U1_R1
differential pair; differential pair class Diff_100Ohm: (no net found under the mark)

### Notes on the sheet
- 2.5V
- RF switch signals
- 2026
- SINARA
- Project:
- Designed by:
- Filename:
- Size:
- Version:
- Last mod. date :
- Sheet:
- A4
- Copyright _______________
  This source describes Open Hardware and is licensed under the CERN-OHL-W v2. You may redistribute and modify this documentation and make products using it under the terms of the CERN-OHL-W v2 (https:/cern.ch/cern-ohl). This documentation is distributed WITHOUT ANY EXPRESS OR IMPLIED WARRANTY, INCLUDING OF MERCHANTABILITY, SATISFACTORY QUALITY AND FITNESS FOR A PARTICULAR PURPOSE. Please see the CERN-OHL-W v2 for applicable conditions.
  As per CERN-OHL-W v2 section 4.1, should You produce hardware based on these sources, You must maintain the Source Location visible on the external case of the product you make using this documentation.
  Source location: =Github
- Last mod. by :
- (in symbol CMP-0962-00001-1, part D) BANK 3
- (in symbol R0201_140R_1%_0.05W_200PPM) 1%
- (in symbol R0402_120R_1%_0.0625W_100PPM) 1%

### Library data of the parts
LD19 = LED_AVAGO_HSMC-C120: LED Red 1C 2A; Part Description: High Performance Right Angle Chip Red LED; Manufacturer: AVAGO TECHNOLOGIES; PressFit: No; Bonding: No; Part Number: LED_AVAGO_HSMC-C120; Component Kind: Standard; Component Type: Standard; Color: Red; PackageDescription: Red Chip LED, 2-Leads, Body 1.7x1.1mm, Side Emitting Package; Manufacturer Part Number: HSMC-C120; Pin Count: 2; Mounted: Yes; Socket: No; SMD: Yes; Sense: No; ComponentHeight: 0.7mm; HelpURL: \\cern.ch\dfs\Applications\Altium\Datasheets\LED_AVAGO_HSMC-C120.pdf; ComponentLink1URL: \\cern.ch\dfs\Applications\Altium\Datasheets\LED_AVAGO_HSMC-C120_DESIGN-GUIDE.pdf; ComponentLink1Description: Design Guide; Author: CERN DEM JMW; CreateDate: 22.07.2009; LatestRevisionDate: 20.06.2012
R11 = R0402_240R_1%_0.0625W_100PPM: Resistor - 1%; Part Description: General Purpose Thick Film Chip Resistor; Manufacturer: GENERIC; Manufacturer1 Part Number: 232270672401L; TC: ±100ppm/°C; PressFit: No; Part Number: R0402_240R_1%_0.0625W_100PPM; Component Kind: Standard; Component Type: Standard; Pin Count: 2; Value: 240; Status: Not Recommended; Power: 0.0625W; Tolerance: ±1%; Manufacturer Part Number: R0402_240R_1%_0.0625W_100PPM; Case: 0402; Mounted: Yes; Sense: No; Socket: No; SMD: Yes; Manufacturer1 Example: YAGEO PHYCOMP; Manufacturer1 ComponentHeight: 0.4mm; HelpURL: \\cern.ch\dfs\Applications\Altium\Datasheets\R0402_Phycomp_RC0402.pdf; Author: CERN DEM JLC; CreateDate: 03.12.2007; LatestRevisionDate: 17.10.2012
R83 R203 R208 R211 R214 R217 R322 R325 R328 R331 R334 R337 R340 R343 R346 R349 = R0402_120R_1%_0.0625W_100PPM: Resistor - 1%; Part Description: General Purpose Thick Film Chip Resistor; Manufacturer: GENERIC; Manufacturer1 Part Number: 232270671201L; TC: ±100ppm/°C; PressFit: No; Part Number: R0402_120R_1%_0.0625W_100PPM; Component Kind: Standard; Component Type: Standard; Pin Count: 2; Value: 120; Status: Not Recommended; Power: 0.0625W; Tolerance: ±1%; Manufacturer Part Number: R0402_120R_1%_0.0625W_100PPM; Case: 0402; Mounted: Yes; Sense: No; Socket: No; SMD: Yes; Manufacturer1 Example: YAGEO PHYCOMP; Manufacturer1 ComponentHeight: 0.4mm; HelpURL: \\cern.ch\dfs\Applications\Altium\Datasheets\R0402_Phycomp_RC0402.pdf; Author: CERN DEM JLC; CreateDate: 03.12.2007; LatestRevisionDate: 17.10.2012
R85 R199 R200 R206 R207 R209 R210 R212 R213 R215 R216 R320 R321 R323 R324 R326 R327 R329 R330 R332 R333 R335 R336 R338 R339 R341 R342 R344 R345 R347 R348 R350 = R0201_140R_1%_0.05W_200PPM: Resistor - 1%; Part Description: Thick Film Chip Resistor; Manufacturer: GENERIC; Manufacturer1 Part Number: CRCW0201140RFNED; Power: 0.05W; TC: ±200ppm/°C; PressFit: No; Part Number: R0201_140R_1%_0.05W_200PPM; Component Kind: Standard; Component Type: Standard; Pin Count: 2; Value: 140; Status: Not Recommended; Tolerance: ±1%; Manufacturer Part Number: R0201_140R_1%_0.05W_200PPM; Case: 0201; Mounted: Yes; Sense: No; Socket: No; SMD: Yes; Manufacturer1 Example: VISHAY; Manufacturer1 ComponentHeight: 0.27mm; HelpURL: \\cern.ch\dfs\Applications\Altium\Datasheets\R0201_VISHAY_CRCW e3.pdf; Author: CERN DEM MR; CreateDate: 26/01/2016; LatestRevisionDate: 26/01/2016
T16 = BSS138LT1G: N-CHANNEL MOSFET WITH DIODE; Part Description: 50V 200mA N-Channel Enhancement Mode Field-Effect Transistor; Manufacturer: ON SEMICONDUCTOR; PressFit: No; Bonding: No; Part Number: BSS138LT1G; Component Kind: Standard; Component Type: Standard; Device: BSS138LT1G; PackageDescription: SOT23 3-Leads, Pitch 0.95mm - Body 1.4x3mm, IPC Medium Density; Manufacturer Part Number: BSS138LT1G; Pin Count: 3; Case: SOT23-3; Mounted: Yes; Socket: No; SMD: Yes; Sense: No; ComponentHeight: 1.11mm; HelpURL: \\cern.ch\dfs\Applications\Altium\Datasheets\BSS138LT1G.pdf; Author: CERN DEM JLC; CreateDate: 23.03.2009; LatestRevisionDate: 23.03.2009
U1 = CMP-0962-00001-1: as U1 on sheet Urukul_FPGA; PackageReference: caBGA-256; PackageDescription: 256-Ball Chip Array Ball Grid Array, Body 14 x 14 mm, Pitch 0.8 mm; RoHS: TRUE; Packing: Tray; Mounting Technology: Surface Mount; ComponentLink3URL: http://www.latticesemi.com/lit/docs/package/pkg.pdf; ComponentLink1Description: Manufacturer URL; ComponentLink3Description: Package Specification; Code_JEDEC: MO-275; PackageVersion: Rev. 03.9, 02/2013; ComponentLink1URL: http://www.latticesemi.com/en; ComponentLink2URL: http://www.latticesemi.com/~/media/Documents/DataSheets/iCE/iCE40LPHXFamilyDataSheet.pdf; Manufacturer Part Number: ICE40HX8K-CT256; ComponentLink2Description: Datasheet; DatasheetVersion: Rev. 02.9; Part Number: ICE40HX8K-CT256

## Sheet I2C_switch.SchDoc: =DocumentName
size A4; SPICEModelCacheVGBTAUBO: <root> / <DocumentId>VGBTAUBO</DocumentId> / </root>; DocumentNumber: 1; Revision: 0; SheetNumber: 11; SheetTotal: 20; Version: 1.6; Author 1: Grzegorz Kasprowicz; Author 2: Filip Światkowski, Paweł Kulik, Maciej Przybysz; Author 3: Krzysztof Belewicz; Github: https://github.com/sinara-hw/Urukul; Last modified by: Maciej Przybysz
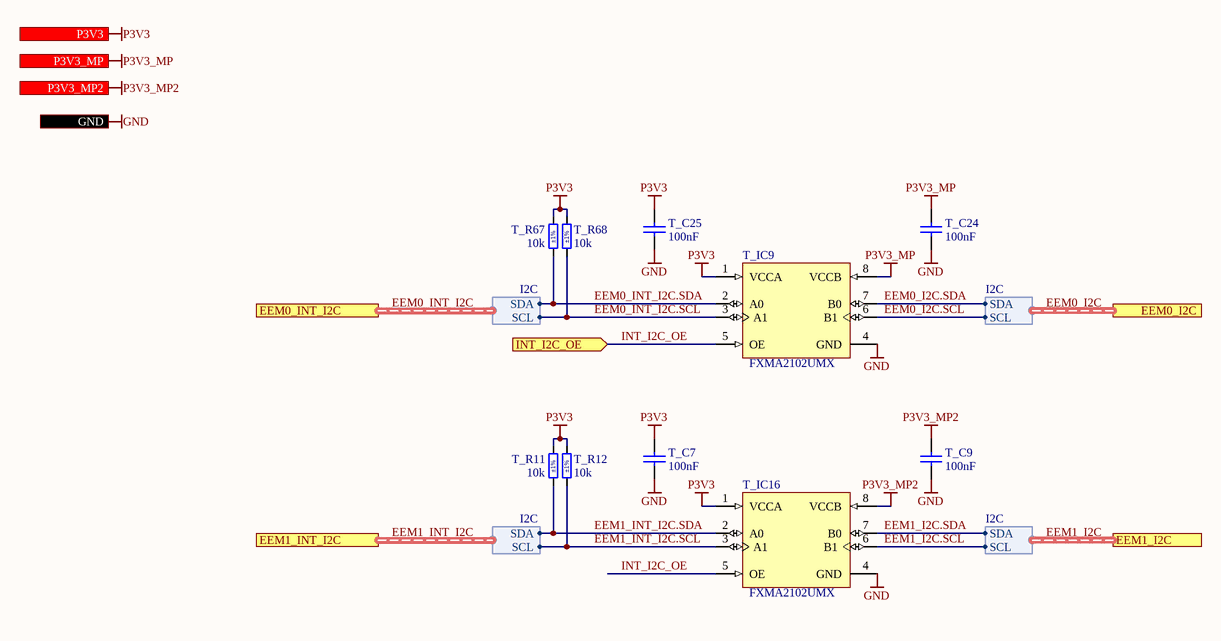
[diagram p15: I2C_switch.SchDoc]

### Parts
T_C7  100nF  [CAPC1005X55N]
T_C9  100nF  [CAPC1005X55N]
T_C24  100nF  [CAPC1005X55N]
T_C25  100nF  [CAPC1005X55N]
T_IC9  FXMA2102UMX  [FXMA2102UMX]
T_IC16  FXMA2102UMX  [FXMA2102UMX]
T_R11  10k  Tolerance: ±1%  [RESC1005X40N]
T_R12  10k  Tolerance: ±1%  [RESC1005X40N]
T_R67  10k  Tolerance: ±1%  [RESC1005X40N]
T_R68  10k  Tolerance: ±1%  [RESC1005X40N]

### Ports
EEM0_I2C (harness I2C), EEM0_INT_I2C (harness I2C), EEM1_I2C (harness I2C), EEM1_INT_I2C (harness I2C), GND, INT_I2C_OE (in), P3V3 (in), P3V3_MP2 (in), P3V3_MP (in)

### Harnesses
I2C: SDA, SCL

### Nets
GND: T_C7.1 T_C9.1 T_C24.1 T_C25.1 T_IC9.4(GND) T_IC16.4(GND) ; port GND
P3V3: T_C7.2 T_C25.2 T_IC9.1(VCCA) T_IC16.1(VCCA) T_R11.2 T_R12.2 T_R67.2 T_R68.2 ; port P3V3
P3V3_MP: T_C24.2 T_IC9.8(VCCB) ; port P3V3_MP
P3V3_MP2: T_C9.2 T_IC16.8(VCCB) ; port P3V3_MP2
EEM0_I2C.SCL: T_IC9.6(B1) ; port EEM0_I2C.SCL
EEM0_I2C.SDA: T_IC9.7(B0) ; port EEM0_I2C.SDA
EEM0_INT_I2C.SCL: T_IC9.3(A1) T_R68.1 ; port EEM0_INT_I2C.SCL
EEM0_INT_I2C.SDA: T_IC9.2(A0) T_R67.1 ; port EEM0_INT_I2C.SDA
EEM1_I2C.SCL: T_IC16.6(B1) ; port EEM1_I2C.SCL
EEM1_I2C.SDA: T_IC16.7(B0) ; port EEM1_I2C.SDA
EEM1_INT_I2C.SCL: T_IC16.3(A1) T_R12.1 ; port EEM1_INT_I2C.SCL
EEM1_INT_I2C.SDA: T_IC16.2(A0) T_R11.1 ; port EEM1_INT_I2C.SDA
INT_I2C_OE: T_IC9.5(OE) T_IC16.5(OE) ; port INT_I2C_OE

### Buses and harness runs
harness EEM0_I2C = port EEM0_I2C
harness EEM0_INT_I2C = port EEM0_INT_I2C
harness EEM1_I2C = port EEM1_I2C
harness EEM1_INT_I2C = port EEM1_INT_I2C

### Notes on the sheet
- SINARA
- Project:
- Designed by:
- Filename:
- Size:
- Version:
- Last mod. date :
- Sheet:
- A4
- Copyright _______________
  This source describes Open Hardware and is licensed under the CERN-OHL-W v2. You may redistribute and modify this documentation and make products using it under the terms of the CERN-OHL-W v2 (https:/cern.ch/cern-ohl). This documentation is distributed WITHOUT ANY EXPRESS OR IMPLIED WARRANTY, INCLUDING OF MERCHANTABILITY, SATISFACTORY QUALITY AND FITNESS FOR A PARTICULAR PURPOSE. Please see the CERN-OHL-W v2 for applicable conditions.
  As per CERN-OHL-W v2 section 4.1, should You produce hardware based on these sources, You must maintain the Source Location visible on the external case of the product you make using this documentation.
  Source location: =Github
- Last mod. by :

### Library data of the parts
T_C7 T_C9 T_C24 T_C25 = CC0402_100NF_16V_10%_X5R: Non-polarised capacitor; Part Description: SMD Multilayer Chip Ceramic Capacitor; Manufacturer: GENERIC; Manufacturer1 Part Number: GRM155R61C104KA88D; Voltage: 16V; TC: X5R; Tolerance: ±10%; Table: Capacitors SMD; Part Number: CC0402_100NF_16V_10%_X5R; Component Kind: Standard; Component Type: Standard; Pin Count: 2; Value: 100nF; Status: None; Manufacturer Part Number: CC0402_100NF_16V_10%_X5R; Case: 0402; Mounted: Yes; Socket: No; SMD: Yes; Manufacturer1 Example: MURATA; Manufacturer1 ComponentHeight: 0.55mm; HelpURL: \\cern.ch\dfs\Applications\Altium\Datasheets\CC0402_X5R_MURATA_GRM.pdf; Author: CERN DEM JLC; CreateDate: 2013-12-10; LatestRevisionDate: 2013-12-10
T_IC9 T_IC16 = CMP-015-00014-1: Dual Supply 2-Bit Voltage Translator/Buffer/Repeater Isolator for I2C Applications; Manufacturer: Onsemi; Max Supply Voltage: 5.5V; Min Supply Voltage: 1.65V; Min Operating Temperature: -40°C; Pins: 8; Max Operating Temperature: 85°C; Manufacaturer Part Number: FXMA2102UMX; Mounting Technology: Surface Mount
T_R11 T_R12 T_R67 T_R68 = R0402_10K_1%_0.0625W_100PPM: as T_R70 on sheet Urukul_FPGA; Part Number: R0402_10K_1%_0.0625W_100PPM; Component Kind: Standard; Component Type: Standard; Pin Count: 2; Value: 10k; Status: Not Recommended; Power: 0.0625W; Manufacturer Part Number: R0402_10K_1%_0.0625W_100PPM; Case: 0402; Mounted: Yes; Sense: No; Socket: No; SMD: Yes; Manufacturer1 Example: YAGEO PHYCOMP; Manufacturer1 ComponentHeight: 0.4mm; HelpURL: \\cern.ch\dfs\Applications\Altium\Datasheets\R0402_Phycomp_RC0402.pdf; Author: CERN DEM JLC; CreateDate: 03.12.2007; LatestRevisionDate: 17.10.2012